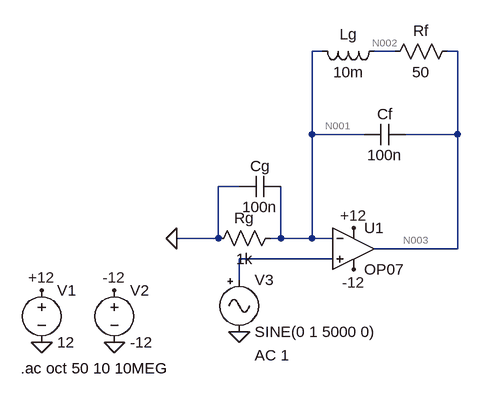
[diagram p0: schematic Draft2.asc]
Draft2.asc, the LTspice schematic file:
Version 4.1
SHEET 1 880 680
WIRE 176 -144 160 -144
WIRE 288 -144 256 -144
WIRE 384 -144 368 -144
WIRE 160 -16 160 -144
WIRE 240 -16 160 -16
WIRE 384 -16 384 -144
WIRE 384 -16 304 -16
WIRE 48 64 16 64
WIRE 16 144 16 64
WIRE 16 144 -48 144
WIRE 112 144 112 64
WIRE 112 144 96 144
WIRE 160 144 160 -16
WIRE 160 144 112 144
WIRE 192 144 160 144
WIRE 384 160 384 -16
WIRE 384 160 256 160
WIRE 192 176 48 176
WIRE 48 208 48 176
FLAG -256 224 +12
FLAG 224 128 +12
FLAG -144 224 -12
FLAG 224 192 -12
FLAG -256 304 0
FLAG -144 304 0
FLAG 48 288 0
FLAG -48 144 0
SYMBOL OpAmps\\OP07 224 96 R0
SYMATTR InstName U1
SYMBOL voltage -256 208 R0
WINDOW 123 0 0 Left 0
WINDOW 39 0 0 Left 0
SYMATTR InstName V1
SYMATTR Value 12
SYMBOL voltage -144 208 R0
WINDOW 123 0 0 Left 0
WINDOW 39 0 0 Left 0
SYMATTR InstName V2
SYMATTR Value -12
SYMBOL Misc\\signal 48 192 R0
WINDOW 123 24 132 Left 2
WINDOW 39 0 0 Left 0
SYMATTR InstName V3
SYMATTR Value SINE(0 1 5000 0)
SYMATTR Value2 AC 1
SYMBOL cap 304 -32 R90
WINDOW 0 0 32 VBottom 2
WINDOW 3 32 32 VTop 2
SYMATTR InstName Cf
SYMATTR Value 100n
SYMBOL cap 112 48 R90
WINDOW 0 0 32 VBottom 2
WINDOW 3 32 32 VTop 2
SYMATTR InstName Cg
SYMATTR Value 100n
SYMBOL res 112 128 R90
WINDOW 0 0 56 VBottom 2
WINDOW 3 32 56 VTop 2
SYMATTR InstName Rg
SYMATTR Value 1k
SYMBOL res 384 -160 R90
WINDOW 0 0 56 VBottom 2
WINDOW 3 32 56 VTop 2
SYMATTR InstName Rf
SYMATTR Value 50
SYMBOL ind 272 -160 R90
WINDOW 0 5 56 VBottom 2
WINDOW 3 32 56 VTop 2
SYMATTR InstName Lg
SYMATTR Value 10m
TEXT -288 344 Left 2 !.ac oct 50 10 10MEG

The netlist it stands for:
* Draft2.asc
X§U1 N004 N001 +12 -12 N003 LT1001  ; OP07, pins In+ In- V+ V- OUT
V1 +12 0 12
V2 -12 0 -12
V3 N004 0 SINE(0 1 5000 0) AC 1
Cf N003 N001 100n
Cg N001 0 100n
Rg N001 0 1k
Rf N003 N002 50
Lg N002 N001 10m
.ac oct 50 10 10MEG
.lib LTC.lib
.backanno
.end

* Results of the author's LTspice run, read from the files saved beside the schematic
* Operating Point, zero values left out:
*   V(-12) = -12 V
*   V(+12) = 12 V
*   I(V1) = -2.25 mA
*   I(V2) = 2.25 mA
*   Ix(u1:3) = 2.25 mA
*   Ix(u1:4) = -2.25 mA
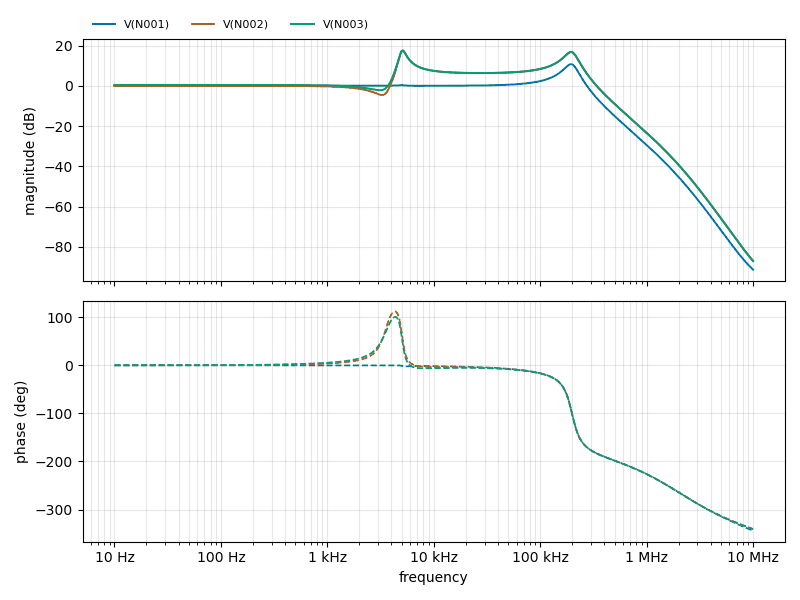
[diagram p1: AC Analysis of Draft2.asc, plotted from the saved traces]
* AC Analysis, 1 run:
*   V(N001): -0.00 dB at 10 Hz, -91.38 dB at 10 MHz, peak 10.74 dB at 196.2 kHz, 3 dB below the peak at 162.9 kHz and 222.2 kHz
*   V(N002): -0.00 dB at 10 Hz, -87.05 dB at 10 MHz, peak 17.34 dB at 5.12 kHz, 3 dB below the peak at 4.77 kHz and 5.633 kHz
*   V(N003): 0.42 dB at 10 Hz, -87.05 dB at 10 MHz, peak 17.58 dB at 5.12 kHz, 3 dB below the peak at 4.76 kHz and 5.615 kHz